# EAGLE schematic BSPD (1) (EAGLE 9.5.1)
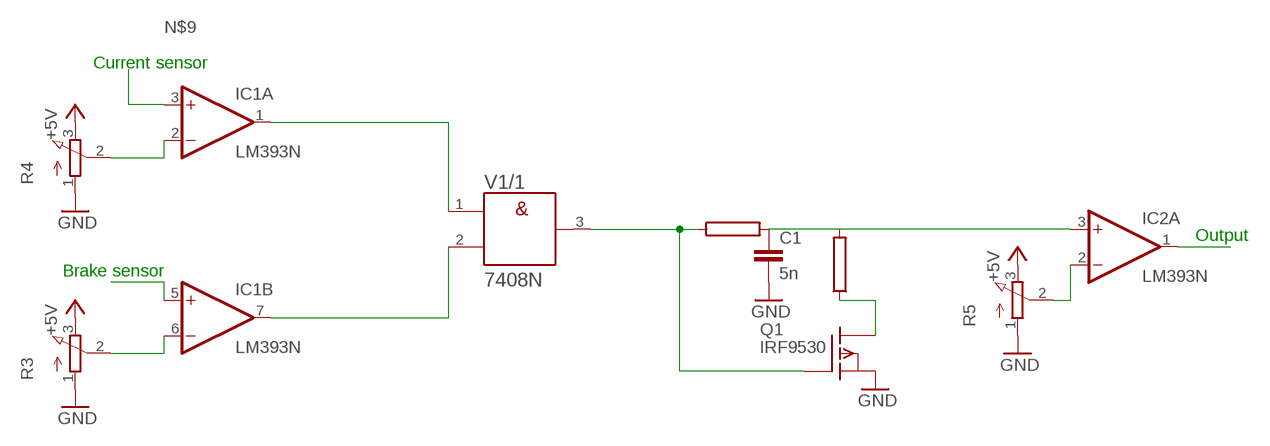
[diagram p0: schematic, sheet 1]

## Parts
C1  5n  C2,5-3  [C2.5-3]
IC1  LM393N  [DIL08]
IC2  LM393N  [DIL08]
Q1  IRF9530  [TO220]
R1  1M  RCA4050  [CA4050]
R2  10k  RCA4050  [CA4050]
R3  3RP/1610N  [3RP/1610N]
R4  3RP/1610N  [3RP/1610N]
R5  3RP/1610N  [3RP/1610N]
V1  7408N  [DIL14]

## Nets
+5V: R3.3(E) R4.3(E) R5.3(E)
GND: C1.2 Q1.3(S) R3.1(A) R4.1(A) R5.1(A)
N$1: IC1.6(B:-IN) R3.2(S)
N$2: IC1.2(A:-IN) R4.2(S)
N$3: IC1.7(B:OUT) V1.2(/1:B)
N$4: IC1.1(A:OUT) V1.1(/1:A)
N$5: Q1.1(G) V1.3(/1:Y)
N$6: IC2.2(A:-IN) R5.2(S)
N$7: C1.1 IC2.3(A:+IN)
N$8: Q1.2(D)
N$9: IC1.3(A:+IN)
N$10: IC1.5(B:+IN)
N$11: IC2.1(A:OUT)
Unconnected: IC2.5(B:+IN) IC2.6(B:-IN) IC2.7(B:OUT) R1.1 R1.2 R2.1 R2.2 V1.4(/2:A) V1.5(/2:B) V1.6(/2:Y) V1.8(/3:Y) V1.9(/3:A) V1.10(/3:B) V1.11(/4:Y) V1.12(/4:A) V1.13(/4:B)

## Notes on the sheet
- Current sensor
- Output
- Brake sensor

## Power pins joined to a net without a drawn wire
+UB: V1.14(/+UB:+UB)
-UB: V1.7(/-UB:-UB)
V+: IC1.8(P:V+) IC2.8(P:V+)
V-: IC1.4(P:V-) IC2.4(P:V-)

## Library data of the parts
C1 = capacitor-wima:C: CAPACITOR naming: grid - package width
IC1 IC2 = linear:LM393: COMPARATOR
Q1 = transistor-fet:IRF9530: P-Channel Enhancement MOSFET (HEXFET); -100V; -12A; 0,3Ohm
R1 R2 = resistor-power:R: Power Resitor; OC_FARNELL: unknown; OC_NEWARK: unknown
R3-R5 = pot:3RP/1610N: 16mm Potentiometer one level Source: http://www.alphapotentiometers.net/html/16mm_pot_2.html
V1 = 74ttl-din:74*08: Quad 2-input AND gate